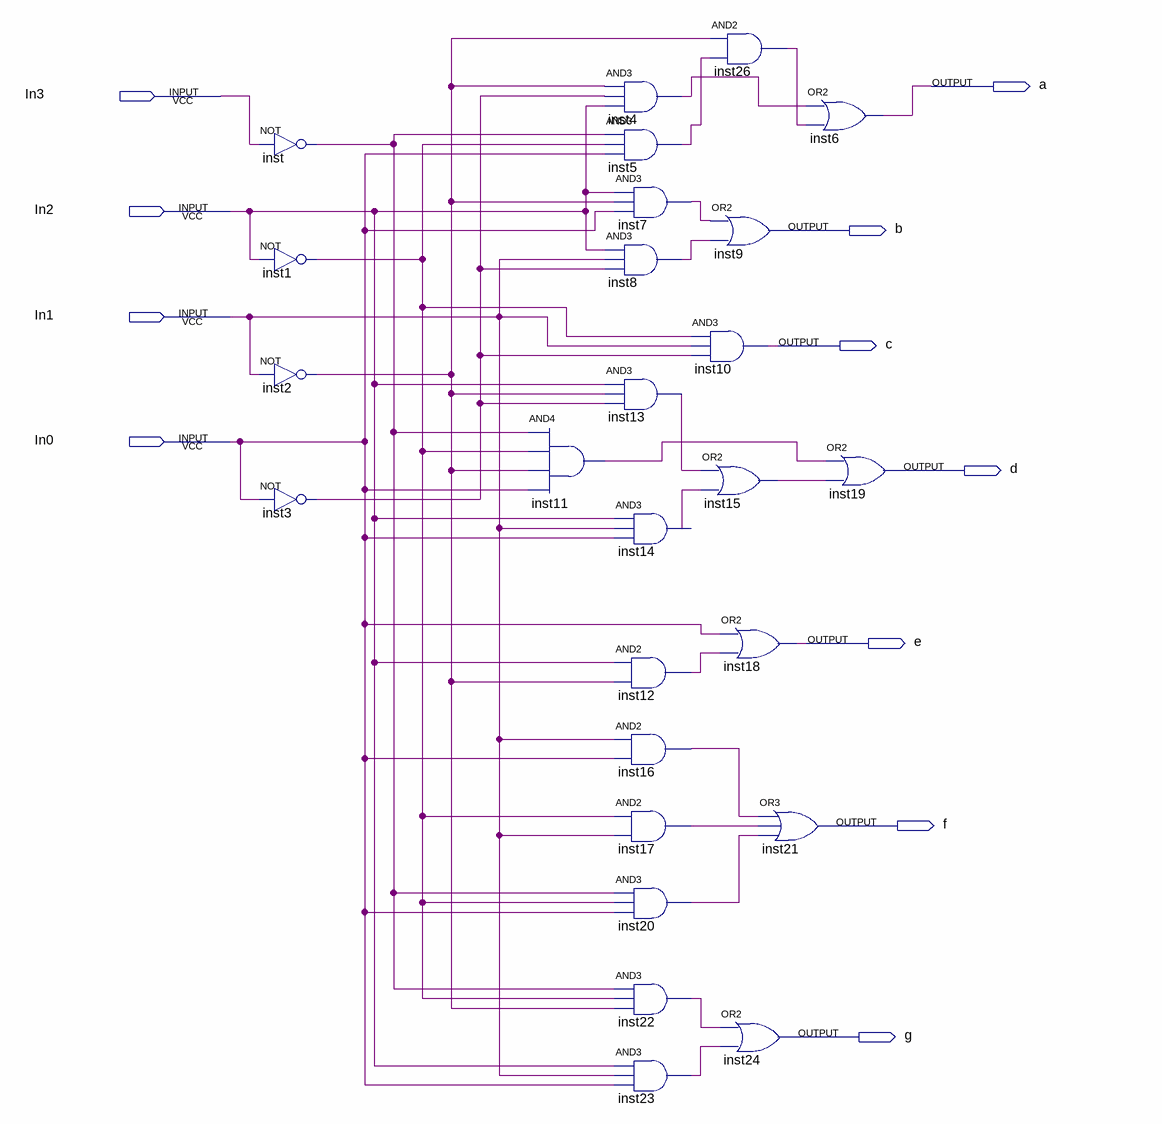
[diagram p0: schematic sheet]
// Quartus schematic display7.bdf as structural Verilog: 26 symbols, 11 pins
module display7 (
  input  In3,
  input  In2,
  input  In1,
  input  In0,
  output a,
  output b,
  output c,
  output d,
  output e,
  output f,
  output g
);

  wire inst1_out, inst2_out, inst3_out, inst4_out, inst5_out, inst7_out, inst8_out, inst11_out, inst12_out,
       inst13_out, inst14_out, inst15_out, inst16_out, inst17_out, inst20_out, inst22_out, inst23_out,
       inst26_out, inst_out;

  not inst (inst_out, In3);
  not inst1 (inst1_out, In2);
  not inst2 (inst2_out, In1);
  not inst3 (inst3_out, In0);
  and inst11 (inst11_out, inst_out, inst1_out, inst2_out, In0);
  and inst4 (inst4_out, inst2_out, inst3_out, In2);
  and inst5 (inst5_out, inst_out, inst1_out, In0);
  and inst7 (inst7_out, In2, inst2_out, In0);
  and inst8 (inst8_out, In2, In1, inst3_out);
  and inst13 (inst13_out, In2, inst2_out, inst3_out);
  and inst14 (inst14_out, In2, In1, In0);
  and inst12 (inst12_out, In2, inst2_out);
  and inst16 (inst16_out, In1, In0);
  and inst17 (inst17_out, inst1_out, In1);
  and inst20 (inst20_out, inst_out, inst1_out, In0);
  and inst22 (inst22_out, inst_out, inst1_out, inst2_out);
  and inst23 (inst23_out, In2, In1, In0);
  and inst26 (inst26_out, inst2_out, inst5_out);
  or inst9 (b, inst7_out, inst8_out);
  and inst10 (c, inst1_out, In1, inst3_out);
  or inst15 (inst15_out, inst13_out, inst14_out);
  or inst18 (e, In0, inst12_out);
  or inst21 (f, inst16_out, inst17_out, inst20_out);
  or inst24 (g, inst22_out, inst23_out);
  or inst6 (a, inst4_out, inst26_out);
  or inst19 (d, inst11_out, inst15_out);
endmodule
